# Altium schematic sheet Sensors.SchDoc
size 431 x 279 mm; SheetNumber: 6; SheetTotal: 6
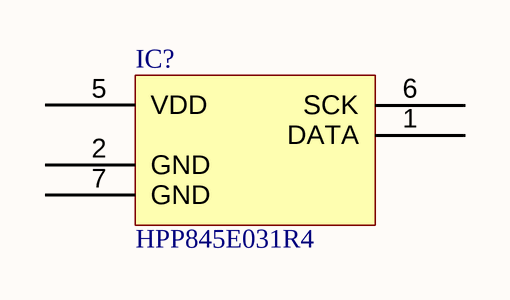
[diagram p0: Sensors.SchDoc]

## Parts
IC?  HPP845E031R4  [TE HPP845E031R4]

## Nets

Not connected (* = marked no-connect by the designer): IC? 1(DATA) 2(GND) 5(VDD) 6(SCK) 7(GND)

## Notes on the sheet
- DWG. NO.
- REV.
- SHT.
- THIS DOCUMENT AND THE DATA DISCLOSED HEREIN OR HEREWITH IS THE PROPERTY OF ALTIUM LIMITED AND MAY BE FREELY DISTRIBUTED IN WHOLE. NO RIGHTS ARE RESERVED OR EXPRESS OR IMPLIED WARANTEE GIVEN.
- REVISION
- DESCRIPTION
- DATE
- APPROVED
- ENG:
- APPROVALS
- PROJECT
- DSN:
- CHK:
- REFERENCE DOCUMENTS
- PROJECT REVISION:
- TITLE
- DOCUMENT REVISION:
- DESIGN ITEM:
- BOM:
- FAB DWG:
- PCB DWG:
- ASSY DWG:
- SCALE:
- SIZE
- B
- CAGE CODE
- FILE NAME
- DWG NO.
- SHEET
- OF
- REV

## Library data of the parts
IC? = HPP845E031R4: SENSOR HUMID/TEMP 3V I2C 2% SMD; Manufacturer: TE Connectivity Measurement Specialties; Accuracy: ±2% RH; Humidity Range: 0 ~ 100% RH; Output: 12b; Output Type: I²C; Response Time: 5s; Sensor Type: Humidity, Temperature; Voltage - Supply: 1.5V ~ 3.6V; Part Number: HPP845E031R4; ComponentLink1Description: Datasheet; ComponentLink1URL: https://www.te.com/commerce/DocumentDelivery/DDEController?Action=srchrtrv&DocNm=HPC199_6&DocType=Data+Sheet&DocLang=English; ComponentLink2Description: DigiKey Link; ComponentLink2URL: http://digikey.com/product-detail/en/te-connectivity-measurement-specialties/HPP845E031R4/223-1144-1-ND/3945773; Device Package: 6-VDFN Exposed Pad; LastUpdated: 2020-05-24 10:55:13 PM; Lifecycle Status: Active; Minimum Order: 1; Mounting Type: Surface Mount; Operating Temperature: -40°C ~ 125°C; Package / Case: 6-VDFN Exposed Pad; Packaging: TapeAndReel; Part Status: Active; Price: 2.87; Series: HTU; Supplier 1: DigiKey; Supplier Part Number 1: 223-1144-1-ND; Supplier Device Package: 6-DFN (3x3)